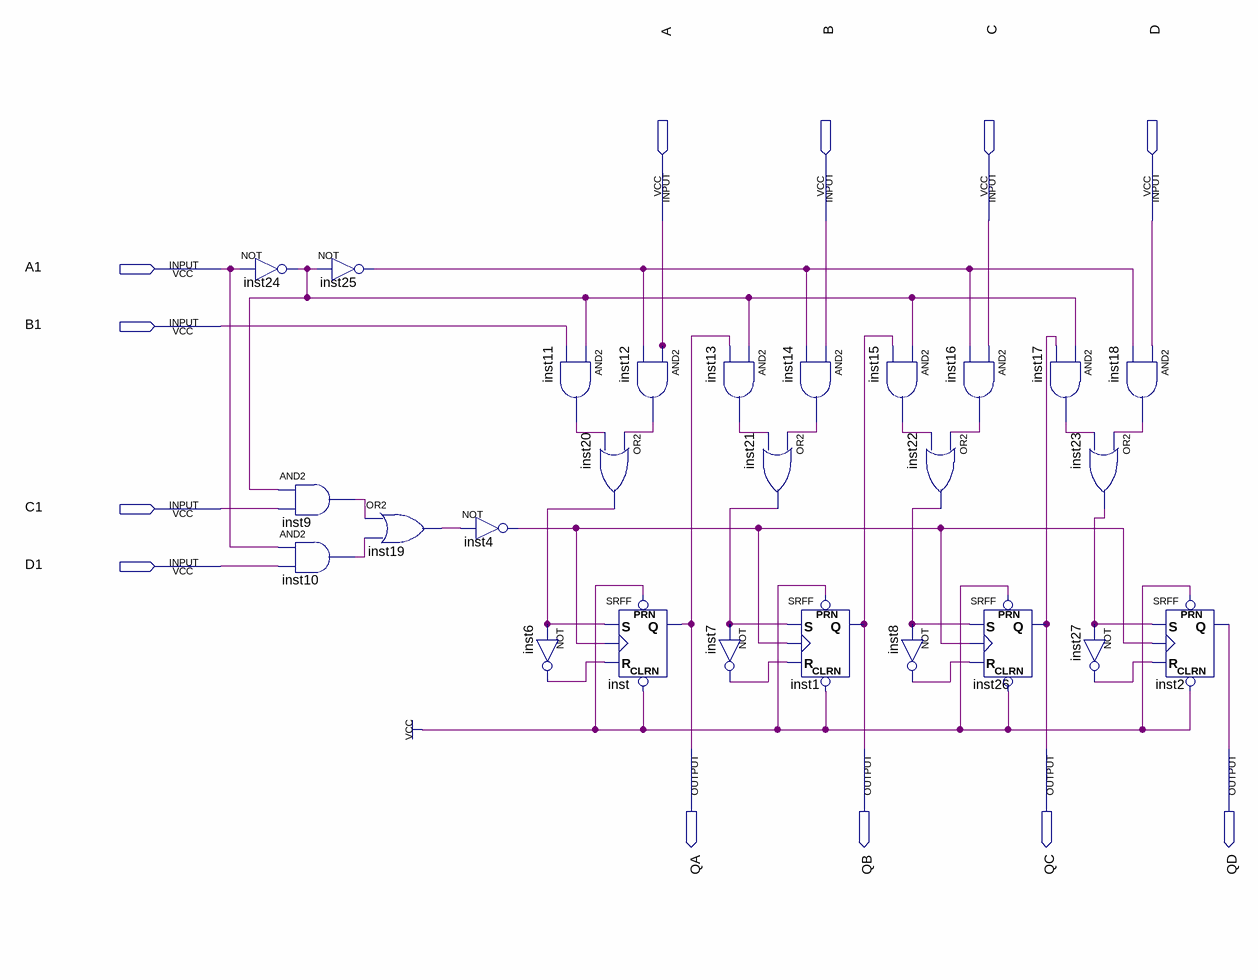
[diagram p0: schematic sheet]
// Quartus schematic Reg.bdf as structural Verilog: 26 symbols, 12 pins
module Reg (
  input  A,
  input  B,
  input  C,
  input  D,
  input  A1,
  input  B1,
  input  C1,
  input  D1,
  output QA,
  output QB,
  output QC,
  output QD
);

  wire inst4_out, inst6_out, inst7_out, inst8_out, inst9_out, inst10_out, inst11_out, inst12_out, inst13_out,
       inst14_out, inst15_out, inst16_out, inst17_out, inst18_out, inst19_out, inst20_out, inst21_out,
       inst22_out, inst23_out, inst24_out, inst25_out, inst27_out;

  not inst24 (inst24_out, A1);
  and inst9 (inst9_out, inst24_out, C1);
  and inst10 (inst10_out, A1, D1);
  not inst25 (inst25_out, inst24_out);
  or inst19 (inst19_out, inst9_out, inst10_out);
  not inst4 (inst4_out, inst19_out);
  and inst11 (inst11_out, inst24_out, B1);
  or inst20 (inst20_out, inst12_out, inst11_out);
  not inst6 (inst6_out, inst20_out);
  and inst12 (inst12_out, A, inst25_out);
  SRFF inst (.PRN(1'b1), .CLRN(1'b1), .S(inst20_out), .R(inst6_out), .CLK(inst4_out), .Q(QA));
  and inst13 (inst13_out, inst24_out, QA);
  or inst21 (inst21_out, inst14_out, inst13_out);
  not inst7 (inst7_out, inst21_out);
  and inst14 (inst14_out, B, inst25_out);
  SRFF inst1 (.PRN(1'b1), .CLRN(1'b1), .S(inst21_out), .R(inst7_out), .CLK(inst4_out), .Q(QB));
  and inst15 (inst15_out, inst24_out, QB);
  not inst8 (inst8_out, inst22_out);
  and inst16 (inst16_out, C, inst25_out);
  or inst22 (inst22_out, inst16_out, inst15_out);
  SRFF inst26 (.PRN(1'b1), .CLRN(1'b1), .S(inst22_out), .R(inst8_out), .CLK(inst4_out), .Q(QC));
  and inst17 (inst17_out, inst24_out, QC);
  and inst18 (inst18_out, D, inst25_out);
  or inst23 (inst23_out, inst18_out, inst17_out);
  not inst27 (inst27_out, inst23_out);
  SRFF inst2 (.PRN(1'b1), .CLRN(1'b1), .S(inst23_out), .R(inst27_out), .CLK(inst4_out), .Q(QD));
endmodule
